# EAGLE design TivaZumoShield (EAGLE 9.4.2)
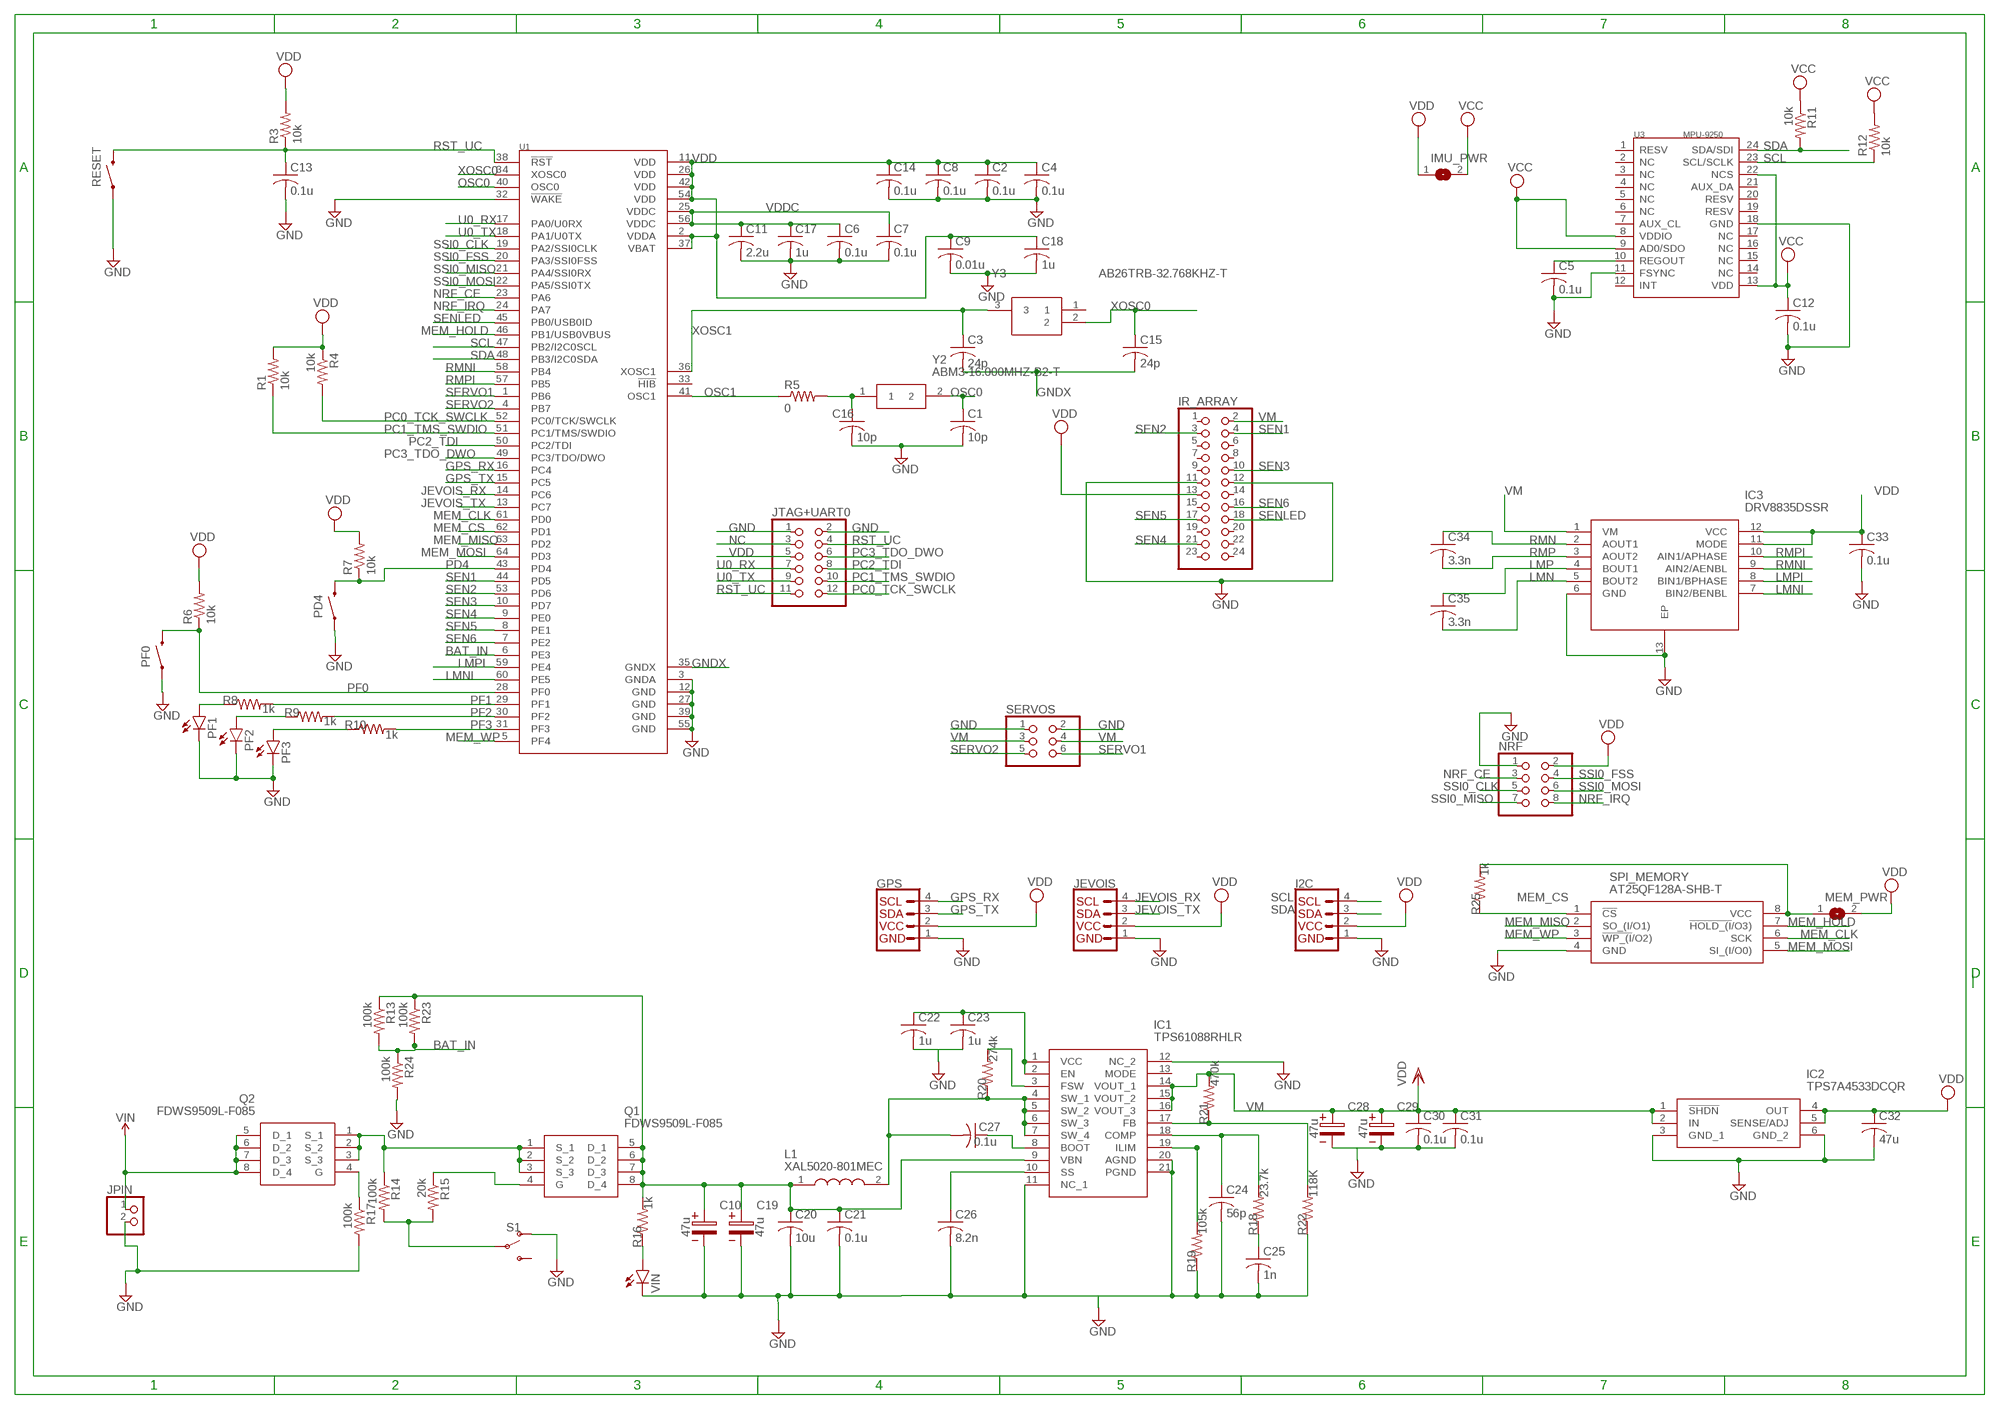
[diagram p0: schematic, sheet 1]

## Parts
C1  10p  C-USC0603  [C0603]
C2  0.1u  C-USC0603  [C0603]
C3  24p  C-USC0603  [C0603]
C4  0.1u  C-USC0603  [C0603]
C5  0.1u  C-USC0603  [C0603]
C6  0.1u  C-USC0603  [C0603]
C7  0.1u  C-USC0603  [C0603]
C8  0.1u  C-USC0603  [C0603]
C9  0.01u  C-USC0603  [C0603]
C10  47u  WCAP-ASLI_5X5,5_865080342006  [3X1.6X1.4(BXCXA)]
C11  2.2u  C-USC0603  [C0603]
C12  0.1u  C-USC0603  [C0603]
C13  0.1u  C-USC0603  [C0603]
C14  0.1u  C-USC0603  [C0603]
C15  24p  C-USC0603  [C0603]
C16  10p  C-USC0603  [C0603]
C17  1u  C-USC0603  [C0603]
C18  1u  C-USC0603  [C0603]
C19  47u  WCAP-ASLI_5X5,5_865080342006  [3X1.6X1.4(BXCXA)]
C20  10u  C-USC0603  [C0603]
C21  0.1u  C-USC0603  [C0603]
C22  1u  C-USC0603  [C0603]
C23  1u  C-USC0603  [C0603]
C24  56p  C-USC0603  [C0603]
C25  1n  C-USC0603  [C0603]
C26  8.2n  C-USC0603  [C0603]
C27  0.1u  C-USC0603  [C0603]
C28  47u  WCAP-ASLI_5X5,5_865080342006  [3X1.6X1.4(BXCXA)]
C29  47u  WCAP-ASLI_5X5,5_865080342006  [3X1.6X1.4(BXCXA)]
C30  0.1u  C-USC0603  [C0603]
C31  0.1u  C-USC0603  [C0603]
C32  47u  C-USC0805K  [C0805K]
C33  0.1u  C-USC0603  [C0603]
C34  3.3n  C-USC0603  [C0603]
C35  3.3n  C-USC0603  [C0603]
GPS  QWIIC_CONNECTORJS-1MM  [1X04_1MM_RA]
I2C  QWIIC_CONNECTORJS-1MM  [1X04_1MM_RA]
IC1  TPS61088RHLR  [RHL(R-PVQFN-N20)_1]
IC2  TPS7A4533DCQR  [SOT127P706X180-6N]
IC3  DRV8835DSSR  [SON50P200X300X80-13N]
IMU_PWR  SJ  [SJ]
IR_ARRAY  PINHD-2X12  [2X12]
JEVOIS  QWIIC_CONNECTORJS-1MM  [1X04_1MM_RA]
JPIN  PINHD-1X2  [1X02]
JTAG+UART0  PINHD-2X6  [2X06]
L1  XAL5020-801MEC  [XAL5020801MEC]
MEM_PWR  SJ  [SJ]
NRF  PINHD-2X4  [2X04]
PD4  RS032G05A3SM-SPST-MOMENTARY-SWSMD-1101NE  [TACTILE-SWITCH-1101NE]
PF0  RS032G05A3SM-SPST-MOMENTARY-SWSMD-1101NE  [TACTILE-SWITCH-1101NE]
PF1  LED-RED0603  [0603-RED]
PF2  LED-GREEN0603  [0603-GREEN]
PF3  LED-BLUE0603  [0603-BLUE]
Q1  FDWS9509L-F085  [FDWS9510LF085]
Q2  FDWS9509L-F085  [FDWS9510LF085]
R1  10k  R-US_R0603  [R0603]
R3  10k  R-US_R0603  [R0603]
R4  10k  R-US_R0603  [R0603]
R5  0  R-US_R0603  [R0603]
R6  10k  R-US_R0603  [R0603]
R7  10k  R-US_R0603  [R0603]
R8  1k  R-US_R0603  [R0603]
R9  1k  R-US_R0603  [R0603]
R10  1k  R-US_R0603  [R0603]
R11  10k  R-US_R0603  [R0603]
R12  10k  R-US_R0603  [R0603]
R13  100k  R-US_R0603  [R0603]
R14  100k  R-US_R0603  [R0603]
R15  20k  R-US_R0603  [R0603]
R16  1k  R-US_R0603  [R0603]
R17  100k  R-US_R0603  [R0603]
R18  23.7k  R-US_R0603  [R0603]
R19  105k  R-US_R0603  [R0603]
R20  274k  R-US_R0603  [R0603]
R21  470k  R-US_R0603  [R0603]
R22  118K  R-US_R0603  [R0603]
R23  100k  R-US_R0603  [R0603]
R24  100k  R-US_R0603  [R0603]
R25  1k  R-US_R0603  [R0603]
RESET  RS032G05A3SM-SPST-MOMENTARY-SWSMD-1101NE  [TACTILE-SWITCH-1101NE]
S1  SWITCH-SPDT-SMD-RIGHT-ANGLE  [SWITCH_SPST_SMD_A]
SERVOS  PINHD-2X3  [2X03]
SPI_MEMORY  AT25QF128A-SHB-T  [SOIC127P790X216-8N]
U1  TM4C123GH6PMI  [QFP50P1200X1200X160-64N]
U3  MPU-9250  [QFN24G-0.4-3X3MM]
VIN  LED-YELLOW0603  [0603-YELLOW]
Y2  ABM3-16.000MHZ-B2-T  [ABM-3]
Y3  AB26TRB-32.768KHZ-T  [AB26TRB]

## Nets
BAT_IN: R13.2 R23.2 R24.1 U1.6(PE3)
GND: C1.2 C2.2 C4.2 C5.2 C6.2 C7.2 C8.2 C9.2 C10.2 C11.2 C12.2 C13.2 C14.2 C16.2 C17.2 C18.2 C19.2 C20.2 C21.2 C22.2 C23.2 C24.2 C25.2 C26.2 C28.2 C29.2 C30.2 C31.2 C32.2 C33.2 GPS.1(GND) I2C.1(GND) IC1.11(NC_1) IC1.12(NC_2) IC1.20(AGND) IC1.21(PGND) IC2.3(GND_1) IC2.6(GND_2) IC3.6(GND) IC3.13(EP) IR_ARRAY.11 IR_ARRAY.12 JEVOIS.1(GND) JPIN.2 JTAG+UART0.1 JTAG+UART0.2 NRF.1 PD4.1 PF0.1 PF1.C PF2.C PF3.C R17.2 R19.1 R22.1 R24.2 RESET.1 S1.1(O) SERVOS.1 SERVOS.2 SPI_MEMORY.4(GND) U1.3(GNDA) U1.12(GND) U1.27(GND) U1.32(!WAKE) U1.39(GND) U1.55(GND) U3.11(FSYNC) U3.18(GND) VIN.C
GNDX: C3.2 C15.2 U1.35(GNDX)
GPS_RX: GPS.4(SCL) U1.16(PC4)
GPS_TX: GPS.3(SDA) U1.15(PC5)
JEVOIS_RX: JEVOIS.4(SCL) U1.14(PC6)
JEVOIS_TX: JEVOIS.3(SDA) U1.13(PC7)
LMN: C35.2 IC3.5(BOUT2)
LMNI: IC3.7(BIN2/BENBL) U1.60(PE5)
LMP: C35.1 IC3.4(BOUT1)
LMPI: IC3.8(BIN1/BPHASE) U1.59(PE4)
MEM_CLK: SPI_MEMORY.6(SCK) U1.61(PD0)
MEM_CS: R25.1 SPI_MEMORY.1(!CS) U1.62(PD1)
MEM_HOLD: SPI_MEMORY.7(!HOLD_(I!/O3)) U1.46(PB1/USB0VBUS)
MEM_MISO: SPI_MEMORY.2(SO_(I/O1)) U1.63(PD2)
MEM_MOSI: SPI_MEMORY.5(SI_(I/O0)) U1.64(PD3)
MEM_WP: SPI_MEMORY.3(!WP_(I!/O2)) U1.5(PF4)
N$1: PF1.A R8.1
N$3: C16.1 R5.2 Y2.1
N$4: R14.2 R15.2 S1.2(P)
N$5: C5.1 U3.10(REGOUT)
N$7 [supply]: MEM_PWR.1 R25.2 SPI_MEMORY.8(VCC)
N$8: C10.1 C19.1 C20.1 C21.1 IC1.9(VBN) L1.1 Q1.5(D_1) Q1.6(D_2) Q1.7(D_3) Q1.8(D_4) R13.1 R16.2 R23.1
N$9: PF2.A R9.1
N$10: PF3.A R10.1
N$12: Q1.4(G) R15.1
N$14: Q1.1(S_1) Q1.2(S_2) Q1.3(S_3) Q2.1(S_1) Q2.2(S_2) Q2.3(S_3) R14.1
N$16: R16.1 VIN.A
N$17: C27.2 IC1.4(SW_1) IC1.5(SW_2) IC1.6(SW_3) IC1.7(SW_4) L1.2 R20.1
N$18: Q2.4(G) R17.1
N$19: C24.1 IC1.18(COMP) R18.2
N$20: C22.1 C23.1 IC1.1(VCC) IC1.2(EN)
N$22: C25.1 R18.1
N$23: IC1.3(FSW) R20.2
N$24: IC1.19(ILIM) R19.2
N$25: C26.1 IC1.10(SS)
N$26: C27.1 IC1.8(BOOT)
N$28: IC1.17(FB) R21.1 R22.2
NC: JTAG+UART0.3
NRF_CE: NRF.3 U1.23(PA6)
NRF_IRQ: NRF.8 U1.24(PA7)
OSC0: C1.1 U1.40(OSC0) Y2.2
OSC1: R5.1 U1.41(OSC1)
PC0_TCK_SWCLK: JTAG+UART0.12 R4.2 U1.52(PC0/TCK/SWCLK)
PC1_TMS_SWDIO: JTAG+UART0.10 R1.1 U1.51(PC1/TMS/SWDIO)
PC2_TDI: JTAG+UART0.8 U1.50(PC2/TDI)
PC3_TDO_DWO: JTAG+UART0.6 U1.49(PC3/TDO/DWO)
PD4: PD4.2 R7.1 U1.43(PD4)
PF0: PF0.2 R6.1 U1.28(PF0)
PF1: R8.2 U1.29(PF1)
PF2: R9.2 U1.30(PF2)
PF3: R10.2 U1.31(PF3)
RMN: C34.1 IC3.2(AOUT1)
RMNI: IC3.9(AIN2/AENBL) U1.58(PB4)
RMP: C34.2 IC3.3(AOUT2)
RMPI: IC3.10(AIN1/APHASE) U1.57(PB5)
RST_UC: C13.1 JTAG+UART0.4 JTAG+UART0.11 R3.1 RESET.2 U1.38(!RST)
SCL: I2C.4(SCL) R12.1 U1.47(PB2/I2C0SCL) U3.23(SCL/SCLK)
SDA: I2C.3(SDA) R11.2 U1.48(PB3/I2C0SDA) U3.24(SDA/SDI)
SEN1: IR_ARRAY.4 U1.44(PD5)
SEN2: IR_ARRAY.3 U1.53(PD6)
SEN3: IR_ARRAY.10 U1.10(PD7)
SEN4: IR_ARRAY.21 U1.9(PE0)
SEN5: IR_ARRAY.17 U1.8(PE1)
SEN6: IR_ARRAY.16 U1.7(PE2)
SENLED: IR_ARRAY.18 U1.45(PB0/USB0ID)
SERVO1: SERVOS.6 U1.1(PB6)
SERVO2: SERVOS.5 U1.4(PB7)
SSI0_CLK: NRF.5 U1.19(PA2/SSI0CLK)
SSI0_FSS: NRF.4 U1.20(PA3/SSI0FSS)
SSI0_MISO: NRF.7 U1.21(PA4/SSI0RX)
SSI0_MOSI: NRF.6 U1.22(PA5/SSI0TX)
U0_RX: JTAG+UART0.7 U1.17(PA0/U0RX)
U0_TX: JTAG+UART0.9 U1.18(PA1/U0TX)
VCC [supply2]: C12.1 IMU_PWR.2 R11.1 R12.2 U3.8(VDDIO) U3.9(AD0/SDO) U3.13(VDD) U3.22(NCS)
VDD [supply]: C2.1 C4.1 C8.1 C9.1 C14.1 C18.1 C32.1 C33.1 GPS.2(VCC) I2C.2(VCC) IC2.4(OUT) IC2.5(SENSE/ADJ) IC3.11(MODE) IC3.12(VCC) IMU_PWR.1 IR_ARRAY.13 JEVOIS.2(VCC) JTAG+UART0.5 MEM_PWR.2 NRF.2 R1.2 R3.2 R4.1 R6.2 R7.2 U1.2(VDDA) U1.11(VDD) U1.26(VDD) U1.37(VBAT) U1.42(VDD) U1.54(VDD)
VDDC: C6.1 C7.1 C11.1 C17.1 U1.25(VDDC) U1.56(VDDC)
VIN: JPIN.1 Q2.5(D_1) Q2.6(D_2) Q2.7(D_3) Q2.8(D_4)
VM: C28.1 C29.1 C30.1 C31.1 IC1.14(VOUT_1) IC1.15(VOUT_2) IC1.16(VOUT_3) IC2.1(!SHDN) IC2.2(IN) IC3.1(VM) IR_ARRAY.2 R21.2 SERVOS.3 SERVOS.4 ; supply symbol labelled VDD
XOSC0: C15.1 U1.34(XOSC0) Y3.2
XOSC1: C3.1 U1.36(XOSC1) Y3.3
Unconnected: IC1.13(MODE) IR_ARRAY.1 IR_ARRAY.5 IR_ARRAY.6 IR_ARRAY.7 IR_ARRAY.8 IR_ARRAY.9 IR_ARRAY.14 IR_ARRAY.15 IR_ARRAY.19 IR_ARRAY.20 IR_ARRAY.22 IR_ARRAY.23 IR_ARRAY.24 S1.3(S) U1.33(!HIB) U3.1(RESV) U3.2(NC) U3.3(NC) U3.4(NC) U3.5(NC) U3.6(NC) U3.7(AUX_CL) U3.12(INT) U3.14(NC) U3.15(NC) U3.16(NC) U3.17(NC) U3.19(RESV) U3.20(RESV) U3.21(AUX_DA) Y3.1

## Library data of the parts
C1-C9 C11-C18 C20-C27 C30-C35 = rcl:C-US: CAPACITOR, American symbol; SPICEPREFIX: C
C10 C19 C28 C29 = Wurth_Elektronik_Passive_Capacitors_rev18b:WCAP-ASLI: WCAP-ASLI Aluminum Electrolytic Capacitors Characteristics Aluminum Electrolytic Capacitor Recommended soldering: Reflow Operating temperature: -55 °C to +105 °C Low impedance product series Load life:2000 h @ +105 °C Package name and Variant abbreviation: Package: Package: B X C X A = length of the solder pad X width of the solder pad X pitch of the solder pad. <http://katalog.we-online.de/media/images/eisos/WCAP-ASLI_pf2.jpg> Details see: http://katalog.we-online.de/en/pbs/WCAP-ASLI Updated by: Yingchun,Shan Updated: 2017-03-16 2017 (C) Wurth Elektronik; WE-NUMBER: 865080342006/47uF
GPS I2C JEVOIS = SparkFun-Connectors:QWIIC_CONNECTOR: SparkFun I2C Standard Qwiic Connector An SMD 1mm pitch JST connector makes it easy and quick (get it? Qwiic?) to connect I2C devices to each other. The Qwiic system <http://www.sparkfun.com/qwiic> enables fast and solderless connection between popular platforms and various sensors and actuators. We carry 200mm <https://www.sparkfun.com/products/14204>, 100mm <https://www.sparkfun.com/products/14205>, 50mm <https://www.sparkfun.com/products/14206>, and breadboard friendly <https://www.sparkfun.com/products/14207> Qwiic cables. We also offer 10 pcs strips <https://www.sparkfun.com/products/14323> the SMD connectors.
IC1 = TPS61088RHLR:TPS61088RHLR: 10-A Fully-Integrated Synchronous Boost Converter Source: Datasheet <http://www.ti.com/lit/gpn/tps61088>; DESCRIPTION: 10-A Fully-Integrated Synchronous Boost Converter; HEIGHT: mm; MANUFACTURER_NAME: Texas Instruments; MANUFACTURER_PART_NUMBER: TPS61088RHLR; MOUSER_PART_NUMBER: 595-TPS61088RHLR; MOUSER_PRICE-STOCK: https://www.mouser.com/Search/Refine.aspx?Keyword=595-TPS61088RHLR
IC2 = TPS7A4533DCQR:TPS7A4533DCQR: Low-Noise Fast-Transient-Response 1.5-A Low-Dropout Voltage Regulators Source: Datasheet <http://www.mouser.com/ds/2/405/tps7a4533-449443.pdf>; DESCRIPTION: Low-Noise Fast-Transient-Response 1.5-A Low-Dropout Voltage Regulators; HEIGHT: 1.8mm; MANUFACTURER_NAME: Texas Instruments; MANUFACTURER_PART_NUMBER: TPS7A4533DCQR; MOUSER_PART_NUMBER: 595-TPS7A4533DCQR; MOUSER_PRICE-STOCK: https://www.mouser.com/Search/Refine.aspx?Keyword=595-TPS7A4533DCQR
IC3 = DRV8835DSSR:DRV8835DSSR: Dual Low Voltage H-Bridge 1.5A WSON12EP Texas Instruments DRV8835DSSR Stepper Motor Driver IC, 11 V 1.5A, 12-Pin WSON Source: Datasheet <http://www.ti.com/general/docs/lit/getliterature.tsp?genericPartNumber=drv8835&fileType=pdf>; DESCRIPTION: Dual Low Voltage H-Bridge 1.5A WSON12EP Texas Instruments DRV8835DSSR Stepper Motor Driver IC, 11 V 1.5A, 12-Pin WSON; HEIGHT: 0.8mm; MANUFACTURER_NAME: Texas Instruments; MANUFACTURER_PART_NUMBER: DRV8835DSSR; MOUSER_PART_NUMBER: 595-DRV8835DSSR; MOUSER_PRICE-STOCK: https://www.mouser.com/Search/Refine.aspx?Keyword=595-DRV8835DSSR; RS_PART_NUMBER: 8136485; RS_PRICE-STOCK: https://uk.rs-online.com/web/p/products/8136485
IMU_PWR MEM_PWR = jumper:SJ: SMD solder JUMPER
IR_ARRAY = pinhead:PINHD-2X12: PIN HEADER
JPIN = DC_LOAD_AU:PINHD-1X2: PIN HEADER
JTAG+UART0 = pinhead:PINHD-2X6: PIN HEADER
L1 = XAL5020-801MEC:XAL5020-801MEC: Fixed Inductors 0.8uH 20% 13A 11.8mOhms AEC-Q200 Source: Datasheet <https://www.coilcraft.com/pdfs/xal5020.pdf>; DESCRIPTION: Fixed Inductors 0.8uH 20% 13A 11.8mOhms AEC-Q200; HEIGHT: 2mm; MANUFACTURER_NAME: COILCRAFT; MANUFACTURER_PART_NUMBER: XAL5020-801MEC; MOUSER_PART_NUMBER: 994-XAL5020-801MEC; MOUSER_PRICE-STOCK: https://www.mouser.com/Search/Refine.aspx?Keyword=994-XAL5020-801MEC
NRF = pinhead:PINHD-2X4: PIN HEADER
PD4 PF0 RESET = BeagleBone_Blue_R3:RS032G05A3SM-SPST-MOMENTARY-SW: 6x3.5mm 2-pin Momentary Switch (Push-button) Digikey Link <https://www.digikey.com/products/en?keywords=CKN10388TR-ND> Datasheet <https://media.digikey.com/pdf/Data%20Sheets/C&K/RS-032G05_-SM_RT.pdf>; PROD_ID: SWCH-00815
PF1 = BeagleBone_Blue_R3:LED-RED
PF2 = BeagleBone_Blue_R3:LED-GREEN
PF3 = BeagleBone_Blue_R3:LED-BLUE
Q1 Q2 = FDWS9509L-F085:FDWS9509L-F085: PMOS PWR56 40V 8 MOHM Source: Datasheet <http://www.onsemi.com/pub/Collateral/FDWS9509L-F085-D.PDF>; DESCRIPTION: PMOS PWR56 40V 8 MOHM; HEIGHT: mm; MANUFACTURER_NAME: ON Semiconductor; MANUFACTURER_PART_NUMBER: FDWS9509L-F085; MOUSER_PART_NUMBER: 863-FDWS9509L-F085; MOUSER_PRICE-STOCK: https://www.mouser.com/Search/Refine.aspx?Keyword=863-FDWS9509L-F085; RS_PART_NUMBER: 1784501P; RS_PRICE-STOCK: http://uk.rs-online.com/web/p/products/1784501P
R1 R3-R25 = rcl:R-US_: RESISTOR, American symbol; SPICEPREFIX: R
S1 = SparkFun-Switches:SWITCH-SPDT: Single Pole, Double Throw (SPDT) Switch Single-pole, double-throw (SPDT) switch. Variant Overview SMD-AYZ0202 Surface Mount DPDT Switch <https://www.sparkfun.com/products/597> (COM-00597) Used on e.g. LilyPad Arduino USB - ATmega32U4 Board <https://www.sparkfun.com/products/12049> PTH-11.6X4.0MM SPDT Mini Power Switch <https://www.sparkfun.com/products/102> (COM-00102) Used on e.g. SparkFun Simon Says - Through-Hole Soldering Kit <https://www.sparkfun.com/products/10547> (KIT-10547) PTH-11.6X4.0MM-KIT KIT version of SPDT Mini Power Switch - Simplifies soldering by removing tStop of switch pins - only one side can be soldered. PTH-11.6X4.0MM-LOCK LOCK version of SPDT Mini Power Switch - Offset pins hold switch in place for easier soldering. SMD-RIGHT-ANGLE Surface Mount Right Angle Switch <https://www.sparkfun.com/products/10860> (COM-10860) Used on e.g. SparkFun ESP8266 Thing <https://www.sparkfun.com/products/13231>; PROD_ID: SWCH-10651; SF_SKU: COM-10860
SERVOS = pinhead:PINHD-2X3: PIN HEADER
SPI_MEMORY = AT25QF128A-SHB-T:AT25QF128A-SHB-T: NOR Flash 128Mb, 133MHz, QPI,8-SOIC-W, IND TEMP, 2.7-3.6V, T&R Source: Datasheet <https://www.adestotech.com/wp-content/uploads/AT25QF128A_Data_Sheet_RevA_03-19-2019-1.pdf>; DESCRIPTION: NOR Flash 128Mb, 133MHz, QPI,8-SOIC-W, IND TEMP, 2.7-3.6V, T&R; HEIGHT: 2.16mm; MANUFACTURER_NAME: Adesto Technologies; MANUFACTURER_PART_NUMBER: AT25QF128A-SHB-T; MOUSER_PART_NUMBER: 988-AT25QF128A-SHB-T; MOUSER_PRICE-STOCK: https://www.mouser.com/Search/Refine.aspx?Keyword=988-AT25QF128A-SHB-T
U1 = TM4C123GH6PMI:TM4C123GH6PMI: MCU 32-Bit Tiva C ARM Cortex M4F RISC 256KB Flash 1.2V/3.3V 64-Pin LQFP Tray/Tube; AVAILABILITY: Unavailable; DESCRIPTION: MCU 32-Bit Tiva C ARM Cortex M4F RISC 256KB Flash 1.2V/3.3V 64-Pin LQFP Tray/Tube; MF: Texas Instruments; MP: TM4C123GH6PMI; PACKAGE: LQFP-64 Texas Instruments; PRICE: None
U3 = BeagleBone_Blue_R3:MPU-9250: 314990005; MPN: MPU-9250
VIN = BeagleBone_Blue_R3:LED-YELLOW
Y2 = ABM3-16.000MHZ-B2-T:ABM3-16.000MHZ-B2-T: ABRACON - ABM3-16.000MHZ-B2-T - CRYSTAL, 16MHZ, 18PF CL, 5X3.2MM, SMT Source: Datasheet <https://abracon.com/Resonators/abm3.pdf>; DESCRIPTION: ABRACON - ABM3-16.000MHZ-B2-T - CRYSTAL, 16MHZ, 18PF CL, 5X3.2MM, SMT; HEIGHT: mm; MANUFACTURER_NAME: ABRACON; MANUFACTURER_PART_NUMBER: ABM3-16.000MHZ-B2-T; MOUSER_PART_NUMBER: 815-ABM3-16-B2-T; MOUSER_PRICE-STOCK: https://www.mouser.com/Search/Refine.aspx?Keyword=815-ABM3-16-B2-T
Y3 = AB26TRB-32.768KHZ-T:AB26TRB-32.768KHZ-T: ABRACON - AB26TRB-32.768KHZ-T - CRYSTAL, 32.768KHZ, 12.5PF, SMD Source: Datasheet <http://www.abracon.com/Resonators/AB26TRB.pdf>; DESCRIPTION: ABRACON - AB26TRB-32.768KHZ-T - CRYSTAL, 32.768KHZ, 12.5PF, SMD; HEIGHT: mm; MANUFACTURER_NAME: ABRACON; MANUFACTURER_PART_NUMBER: AB26TRB-32.768KHZ-T; MOUSER_PART_NUMBER: 815-AB26TRB-32.76KHZ; MOUSER_PRICE-STOCK: https://www.mouser.com/Search/Refine.aspx?Keyword=815-AB26TRB-32.76KHZ

## Net classes
1 supply: width 0.381 mm
2 supply2: width 0.203 mm

## Board
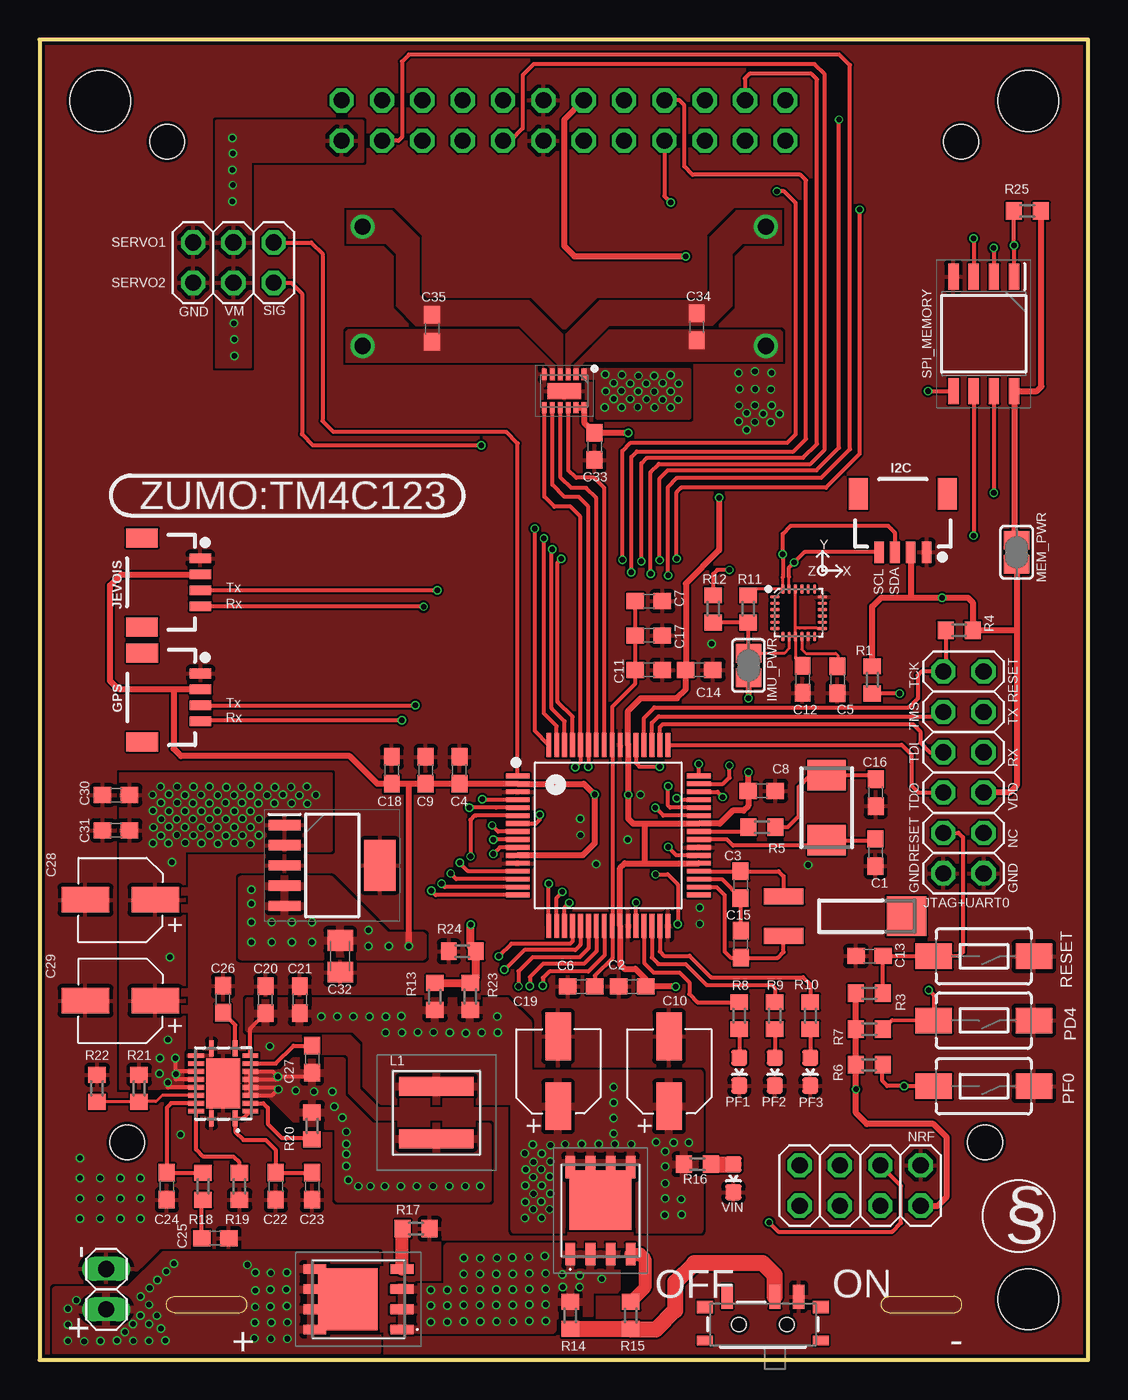
[diagram p1: board, top side]
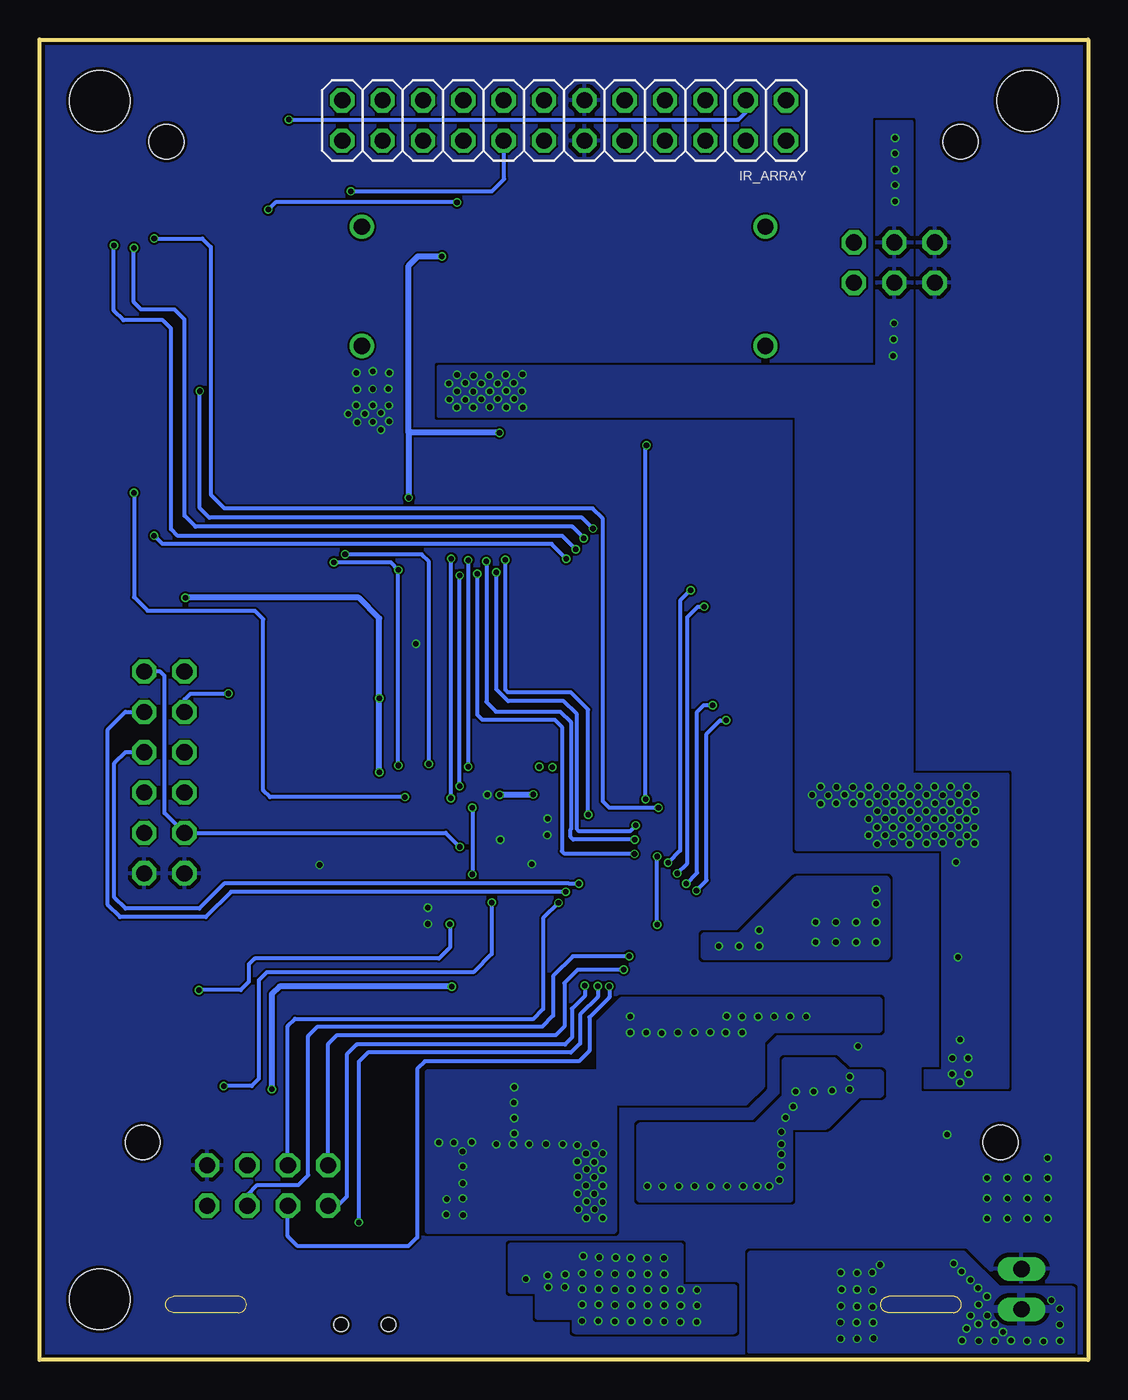
[diagram p2: board, bottom side, seen from below]

Size 66 x 83.1 mm. Coordinates in mm from the lower left corner, seen from the top.
Outline: 0,0 66,0 66,83.1 0,83.1 0,0
Copper layers (1*16): Top 0.035559375mm / dielectric 1.6mm / Bottom 0.035559375mm
Design rules "jlcpcb2layer": minimum track width 5mil, minimum drill 12mil, track to track 5mil, track to pad 5mil, pad to pad 5mil, via to via 5mil, smd to smd 5mil, copper to edge 8mil, drill to drill 6mil, minimum pad ring 5mil, minimum via ring 3mil, stop-mask expansion 2.5mil, vias tented up to drill 0mil, thermal gap 10mil
Holes 2.18 mm at 5.51,13.69 59.51,13.69 58.01,76.68 8.03,76.68
Holes 3.81 mm at 62.23,3.81 62.23,79.25 3.81,79.25
Milling: 8 lines

### Footprints (pad centres in the part's own frame; a part is rotated, then mirrored left to right if it is on the bottom)
C0603 = smd 1.1 x 1: 1 -0.85,0; 2 0.85,0
3X1.6X1.4(BXCXA) = smd 3 x 1.6: 1 2.2,0; 2 -2.2,0
C0805K = smd 1.3 x 1.6: 1 -1,0; 2 1,0
1X04_1MM_RA = smd 0.6 x 1.35: 1 -1.5,0; 2 -0.5,0; 3 0.5,0; 4 1.5,0 | smd 1.2 x 2: NC1 2.8,-3.675; NC2 -2.8,-3.675
RHL(R-PVQFN-N20)_1 = smd 0.99 x 0.3: 1 -2.2,-0.75; 10 2.2,-0.75; 11 2.2,0.75; 20 -2.2,0.75 | smd 0.3 x 0.99: 2 -1.75,-1.7; 3 -1.25,-1.7; 4 -0.75,-1.7; 5 -0.25,-1.7; 6 0.25,-1.7; 7 0.75,-1.7; 8 1.25,-1.7; 9 1.75,-1.7; 12 1.75,1.7; 13 1.25,1.7; 14 0.75,1.7; 15 0.25,1.7; 16 -0.25,1.7; 17 -0.75,1.7; 18 -1.25,1.7; 19 -1.75,1.7 | smd 3.15 x 2.15: 21 0,0
SOT127P706X180-6N = smd 2 x 0.65: 1 -3,2.54; 2 -3,1.27; 3 -3,0; 4 -3,-1.27; 5 -3,-2.54 | smd 2 x 3.2: 6 3,0
SON50P200X300X80-13N = smd 0.7 x 0.3: 1 -1.05,1.25; 2 -1.05,0.75; 3 -1.05,0.25; 4 -1.05,-0.25; 5 -1.05,-0.75; 6 -1.05,-1.25; 7 1.05,-1.25; 8 1.05,-0.75; 9 1.05,-0.25; 10 1.05,0.25; 11 1.05,0.75; 12 1.05,1.25 | smd 1 x 2.1: 13 0,0
SJ = smd 1.168 x 1.6: 1 -0.762,0; 2 0.762,0
2X12 = drill 1.016 octagon: 1 -13.97,-1.27; 2 -13.97,1.27; 3 -11.43,-1.27; 4 -11.43,1.27; 5 -8.89,-1.27; 6 -8.89,1.27; 7 -6.35,-1.27; 8 -6.35,1.27; 9 -3.81,-1.27; 10 -3.81,1.27; 11 -1.27,-1.27; 12 -1.27,1.27; 13 1.27,-1.27; 14 1.27,1.27; 15 3.81,-1.27; 16 3.81,1.27; 17 6.35,-1.27; 18 6.35,1.27; 19 8.89,-1.27; 20 8.89,1.27; 21 11.43,-1.27; 22 11.43,1.27; 23 13.97,-1.27; 24 13.97,1.27
1X02 = drill 1.016 long: 1 -1.27,0; 2 1.27,0
2X06 = drill 1.016 octagon: 1 -6.35,-1.27; 2 -6.35,1.27; 3 -3.81,-1.27; 4 -3.81,1.27; 5 -1.27,-1.27; 6 -1.27,1.27; 7 1.27,-1.27; 8 1.27,1.27; 9 3.81,-1.27; 10 3.81,1.27; 11 6.35,-1.27; 12 6.35,1.27
XAL5020801MEC = smd 1.18 x 4.7: 1 -1.655,0; 2 1.655,0
2X04 = drill 1.016 octagon: 1 -3.81,-1.27; 2 -3.81,1.27; 3 -1.27,-1.27; 4 -1.27,1.27; 5 1.27,-1.27; 6 1.27,1.27; 7 3.81,-1.27; 8 3.81,1.27
TACTILE-SWITCH-1101NE = smd 2.3 x 1.6: 1 -3.15,0; 2 3.15,0
0603-RED = smd 1 x 1: A 0,-0.877; C 0,0.877
0603-GREEN = smd 1 x 1: A 0,-0.877; C 0,0.877
0603-BLUE = smd 1 x 1: A 0,-0.877; C 0,0.877
FDWS9510LF085 = smd 0.61 x 1.42: 1 -1.905,-2.745; 2 -0.635,-2.745; 3 0.635,-2.745; 4 1.905,-2.745 | smd 0.61 x 0.92: 5 1.905,2.995; 6 0.635,2.995; 7 -0.635,2.995; 8 -1.905,2.995 | smd 3.91 x 3.75: 9 0,0.66 | smd 0.255 x 0.5: 10 -2.082,2.285; 11 2.082,2.285
R0603 = smd 1 x 1.1: 1 -0.85,0; 2 0.85,0
SWITCH_SPST_SMD_A = smd 0.7 x 1.5: 1 -2.25,-1.75; 2 -0.75,-1.75; 3 2.25,-1.75 | smd 1 x 0.6: GND1 -3.65,1; GND3 3.65,1 | smd 1 x 0.8: GND2 -3.65,-1.1; GND4 3.65,-1.1 | hole 0.9: -1.5,0; 1.5,0
2X03 = drill 1.016 octagon: 1 -2.54,-1.27; 2 -2.54,1.27; 3 0,-1.27; 4 0,1.27; 5 2.54,-1.27; 6 2.54,1.27
SOIC127P790X216-8N = smd 1.65 x 0.65: 1 -3.6,1.905; 2 -3.6,0.635; 3 -3.6,-0.635; 4 -3.6,-1.905; 5 3.6,-1.905; 6 3.6,-0.635; 7 3.6,0.635; 8 3.6,1.905
QFP50P1200X1200X160-64N = smd 1.5 x 0.3: 1 -5.7,3.75; 2 -5.7,3.25; 3 -5.7,2.75; 4 -5.7,2.25; 5 -5.7,1.75; 6 -5.7,1.25; 7 -5.7,0.75; 8 -5.7,0.25; 9 -5.7,-0.25; 10 -5.7,-0.75; 11 -5.7,-1.25; 12 -5.7,-1.75; 13 -5.7,-2.25; 14 -5.7,-2.75; 15 -5.7,-3.25; 16 -5.7,-3.75; 33 5.7,-3.75; 34 5.7,-3.25; 35 5.7,-2.75; 36 5.7,-2.25; 37 5.7,-1.75; 38 5.7,-1.25; 39 5.7,-0.75; 40 5.7,-0.25; 41 5.7,0.25; 42 5.7,0.75; 43 5.7,1.25; 44 5.7,1.75; 45 5.7,2.25; 46 5.7,2.75; 47 5.7,3.25; 48 5.7,3.75 | smd 0.3 x 1.5: 17 -3.75,-5.7; 18 -3.25,-5.7; 19 -2.75,-5.7; 20 -2.25,-5.7; 21 -1.75,-5.7; 22 -1.25,-5.7; 23 -0.75,-5.7; 24 -0.25,-5.7; 25 0.25,-5.7; 26 0.75,-5.7; 27 1.25,-5.7; 28 1.75,-5.7; 29 2.25,-5.7; 30 2.75,-5.7; 31 3.25,-5.7; 32 3.75,-5.7; 49 3.75,5.7; 50 3.25,5.7; 51 2.75,5.7; 52 2.25,5.7; 53 1.75,5.7; 54 1.25,5.7; 55 0.75,5.7; 56 0.25,5.7; 57 -0.25,5.7; 58 -0.75,5.7; 59 -1.25,5.7; 60 -1.75,5.7; 61 -2.25,5.7; 62 -2.75,5.7; 63 -3.25,5.7; 64 -3.75,5.7
QFN24G-0.4-3X3MM = smd 0.6 x 0.2: 1 -1.5,1; 2 -1.5,0.6; 3 -1.5,0.2; 4 -1.5,-0.2; 5 -1.5,-0.6; 6 -1.5,-1; 13 1.5,-1; 14 1.5,-0.6; 15 1.5,-0.2; 16 1.5,0.2; 17 1.5,0.6; 18 1.5,1 | smd 0.2 x 0.6: 7 -1,-1.5; 8 -0.6,-1.5; 9 -0.2,-1.5; 10 0.2,-1.5; 11 0.6,-1.5; 12 1,-1.5; 19 1,1.5; 20 0.6,1.5; 21 0.2,1.5; 22 -0.2,1.5; 23 -0.6,1.5; 24 -1,1.5
0603-YELLOW = smd 1 x 1: A 0,-0.877; C 0,0.877
ABM-3 = smd 1.9 x 2.4: 1 -2.05,0; 2 2.05,0
AB26TRB = smd 2.5 x 2.5: 1 0,0 | smd 2.5 x 1: 2 7.75,1.25; 3 7.75,-1.25

### Placement (x,y rotation side)
C1  52.61,31.94 270 top
C2  37.31,23.51 180 top
C3  44.12,29.9 270 top
C4  26.43,37.11 90 top
C5  50.22,42.82 270 top
C6  34.11,23.5 180 top
C7  38.35,47.75 0 top
C8  45.47,35.81 0 top
C9  24.3,37.11 90 top
C10  39.62,18.16 270 top
C11  38.35,43.43 0 top
C12  48.03,42.83 270 top
C13  52.24,25.41 180 top
C14  41.53,43.43 0 top
C15  44.15,26.15 90 top
C16  52.63,35.71 270 top
C17  38.35,45.59 0 top
C18  22.17,37.11 90 top
C19  32.64,18.16 270 top
C20  14.21,22.67 90 top
C21  16.38,22.67 90 top
C22  14.86,10.92 270 top
C23  17.14,10.92 270 top
C24  8,10.92 270 top
C25  11.05,7.66 0 top
C26  11.54,22.69 90 top
C27  17.14,18.92 270 top
C28  5.08,28.96 0 top
C29  5.08,22.61 0 top
C30  4.81,35.55 180 top
C31  4.81,33.33 180 top
C32  18.92,25.4 270 top
C33  34.93,57.49 270 top
C34  41.36,65.02 90 top
C35  24.7,64.92 270 top
GPS  10.12,41.7 270 top
I2C  54.34,50.83 180 top
IC1  11.56,17.4 90 top
IC2  18.41,31.11 0 top
IC3  33.02,60.98 270 top
IMU_PWR  44.62,43.71 90 top
IR_ARRAY  32.98,78.01 180 bottom
JEVOIS  10.11,48.94 270 top
JPIN  4.19,4.45 90 top
JTAG+UART0  58.16,36.98 90 top
L1  24.98,15.56 270 top
MEM_PWR  61.5,50.84 270 top
NRF  51.65,10.97 180 top
PD4  59.44,21.36 180 top
PF0  59.44,17.22 180 top
PF1  44.04,18.14 180 top
PF2  46.28,18.14 180 top
PF3  48.51,18.14 180 top
Q1  35.31,9.4 0 top
Q2  20.07,3.81 90 top
R1  52.42,42.81 90 top
R3  52.23,23.07 180 top
R4  57.89,45.93 180 top
R5  45.47,33.53 0 top
R6  52.22,18.57 180 top
R7  52.24,20.81 180 top
R8  44.04,21.67 90 top
R9  46.28,21.67 90 top
R10  48.51,21.67 90 top
R11  44.6,47.27 90 top
R12  42.4,47.27 270 top
R13  24.88,22.87 90 top
R14  33.4,2.79 270 top
R15  37.21,2.79 270 top
R16  41.4,12.32 180 top
R17  23.7,8.25 0 top
R18  10.29,10.92 90 top
R19  12.57,10.92 90 top
R20  17.14,14.73 270 top
R21  6.26,17.09 90 top
R22  3.61,17.09 270 top
R23  27.11,22.88 90 top
R24  26.61,25.71 180 top
R25  62.18,72.32 0 top
RESET  59.44,25.4 180 top
S1  45.53,2.22 180 top
SERVOS  12.2,69.07 0 top
SPI_MEMORY  59.43,64.59 270 top
U1  35.79,33.01 0 top
U3  47.78,47.03 0 top
VIN  43.68,11.43 180 top
Y2  49.54,34.75 270 top
Y3  54.58,27.92 180 top

### Tracks (layer width: path | path; a pad name or v marks a point on that pad's centre or on a via)
BAT_IN  (via drill 0.35)
  Top 0.254: U1.6 27.46,34.26 27.46,34.25 27.38,34.25 27.12,33.99 v27.12,31.69
  Top 0.508: R13.2 27.09,23.72 R23.2 27.46,24.08 R24.1 27.13,26.04 v27.13,27.39
  Bottom 0.254: v27.13,27.39 27.13,31.68 v27.12,31.69
GND  (via drill 0.35, 0.35 pad 0)
  other vias: 2.54,11.43 3.81,11.43 5.08,11.43 5.08,10.16 3.81,10.16 2.54,10.16 2.54,8.89 3.81,8.89 5.08,8.89 6.35,8.89 6.35,10.16 6.35,11.43 2.54,12.7 48.38,31.15 41.56,28.47 41.56,27.44 37.82,35.58 42.31,45.07 37.01,32.75 34.05,33.04 35.03,31.21 34.03,34.07 45.04,61.1 44.02,60.07 46.08,60.08 46.07,62.13 43.99,62.13 46.03,61.1 44.06,61.12 45.03,60.09 45.03,62.22 44.51,59.6 45.54,59.54 46.58,59.54 46.01,59.01 45.03,59.03 44.51,58.54 44,59.09 8.87,14.17 14.49,19.73
  pour Top (rank 3): -2.32,84.03 67.31,84.03 67.31,-1.27 -2.32,-1.27
  pour Bottom (rank 3): 68.58,84.65 68.58,-3.26 -3.81,-3.26 -3.81,84.65
GNDX
  Top 0.254: U1.35 42.94,30.26 44.12,29.07 C3.2 44.12,27.03 C15.2
GPS_RX  (via drill 0.35, 0.35 pad 0)
  Top 0.254: U1.16 24.93,29.26 v24.66,29.53 | v22.79,40.25 10.18,40.25 GPS.4
  Bottom 0.254: v24.66,29.53 24.01,30.18 24.01,39.41 23.17,40.25 v22.79,40.25
GPS_TX  (via drill 0.35, 0.35 pad 0)
  Top 0.254: U1.15 25.51,29.76 v25.3,29.96 | GPS.3 v23.63,41.2 v23.64,41.21
  Bottom 0.254: v25.3,29.96 24.61,30.65 24.61,40.78 24.19,41.21 v23.64,41.21
JEVOIS_RX  (via drill 0.35, 0.35 pad 0)
  Top 0.254: U1.14 26.22,30.26 25.87,30.61 v25.87,30.62 | v24.17,47.41 10.13,47.41 JEVOIS.4
  Bottom 0.254: v25.87,30.62 25.23,31.25 25.23,46.75 24.56,47.41 v24.17,47.41
JEVOIS_TX  (via drill 0.35, 0.35 pad 0)
  Top 0.254: U1.13 26.98,30.76 v26.45,31.29 | JEVOIS.3 v25.02,48.44 v25.02,48.45
  Bottom 0.254: v25.02,48.45 25.68,47.79 25.68,32.05 v26.45,31.29
LMN  (via drill 1.02)
  other vias: 20.32,63.83
  pour Top (isolate 0.127, no thermals): 32.43,61.65 32.43,62.59 30.18,64.84 19.43,64.84 19.27,64.69 19.27,62.82 19.28,62.8 31.75,62.8 32.13,62.43 32.13,61.66 32.14,61.65 32.43,61.65 32.43,61.66
LMNI  (via drill 0.35)
  Top 0.254: v33.72,37.3 34.04,37.62 U1.60 34.04,53.08 33.42,53.7 32.41,53.7 31.77,54.34 IC3.7
LMP  (via drill 1.02)
  other vias: 20.32,71.32
  pour Top (isolate 0.127, no thermals): 32.95,61.66 32.95,64.53 30.81,66.67 24.27,66.67 23.91,67.03 23.91,70.61 22.2,72.32 19.33,72.32 19.33,72.33 19.33,70.28 19.33,70.28 21.77,70.28 22.42,69.62 22.42,66.35 23.67,65.1 30.19,65.1 32.61,62.68 32.61,61.65 32.61,61.65
LMPI  (via drill 0.35)
  Top 0.254: v34.54,37.32 v34.54,37.33 U1.59 34.54,53.71 33.94,54.31 33.05,54.31 32.27,55.09 IC3.8
MEM_CLK  (via drill 0.35)
  Top 0.254: U1.61 33.54,40.49 32.61,41.42 32.61,50.19 v32.84,50.42 | v58.8,51.88 SPI_MEMORY.6
  Bottom 0.254: v32.84,50.42 33.78,51.35 58.27,51.35 v58.8,51.88
MEM_CS  (via drill 0.35)
  Top 0.254: U1.62 33.04,40.19 32.23,41.01 32.23,51.03 v32.26,51.03 | SPI_MEMORY.1 v61.33,70.15 R25.1
  Bottom 0.254: v32.26,51.03 33.1,51.86 57.31,51.86 57.73,52.29 57.73,64.92 58.25,65.45 60.73,65.45 61.33,66.05 v61.33,70.15
MEM_HOLD  (via drill 0.35)
  Top 0.254: U1.46 42.67,35.76 v43,35.43 | v60.07,54.57 SPI_MEMORY.7
  Bottom 0.254: v43,35.43 51.5,35.43 51.92,35.85 51.92,46.62 52.46,47.15 59.21,47.15 60.07,48.01 v60.07,54.57
MEM_MISO  (via drill 0.35)
  Top 0.254: U1.63 32.54,39.89 31.75,40.69 v31.75,51.72 | v60.06,70 SPI_MEMORY.2
  Bottom 0.254: v31.75,51.72 32.47,52.45 56.19,52.45 56.88,53.14 56.88,65.49 57.51,66.12 59.62,66.12 60.07,66.56 v60.07,70 | v60.07,70 | v60.07,70 v60.06,70
MEM_MOSI  (via drill 0.35)
  Top 0.254: U1.64 31.17,39.58 v31.17,52.33 | v55.92,60.98 v55.93,60.99 SPI_MEMORY.5
  Bottom 0.254: v31.17,52.33 31.85,53.01 55.33,53.01 55.92,53.61 v55.92,60.98
MEM_WP  (via drill 0.35)
  Top 0.254: U1.5 28.75,34.76 27.06,34.76 v27.05,34.74 | v58.79,70.59 SPI_MEMORY.3
  Bottom 0.254: v27.05,34.74 30.14,34.74 30.55,35.16 30.55,52.95 31.19,53.6 54.36,53.6 55.23,54.47 55.23,70.05 55.77,70.59 v58.79,70.59
N$1
  Top 0.254: R8.1 PF1.A
N$3
  Top 0.254: R5.2 47.09,33.53 47.79,34.22 47.79,36.07 48.52,36.8 Y2.1 52.39,36.8 C16.1
N$4
  Top 1.016: R14.2 R15.2 37.25,1.9 38.8,1.9 40,3.11 40,4.88 41.2,6.09 45.52,6.09 46.28,5.33 S1.2
N$5
  Top 0.203: U3.10 47.98,44.72 48.23,44.46 50.12,44.46 50.25,44.32 50.25,43.71 C5.1
N$7
  Top 0.381: MEM_PWR.1 61.35,51.75 61.35,60.98 SPI_MEMORY.8 62.77,60.99 63.06,61.27 63.06,72.29 R25.2
N$8  (via drill 0.35)
  Top 0.254: IC1.9 13.26,20.86 C20.1
  other vias: 21.79,21.6 28.82,21.61 39.37,10.16 40.38,10.11 40.41,9.14 39.35,9.1 39.37,11.11 39.37,12.17 39.38,13.12 39.92,13.67 38.8,13.7 36.13,14.25 36.13,15.21 36.14,16.18 36.13,17.16 30.55,8.91 31.59,8.91 31.57,9.96 30.57,9.94 31.07,9.47 31.09,10.45 31.61,10.96 30.56,10.98 31.08,11.49 31.57,11.99 30.59,11.97 31.09,12.44 31.61,12.98 30.54,13 31.05,13.55 32.16,13.5 33.07,13.56 34.13,13.58 35.19,13.58 36.21,13.58 37.25,13.56 32.16,12.48 32.11,11.53 32.14,10.46 32.09,9.47 40.87,13.67 20.76,21.6 19.75,21.61 18.75,21.61 17.73,21.61 28.83,20.6 27.82,20.59 26.83,20.57 25.82,20.6 24.8,20.61 23.8,20.61 22.81,20.59 21.78,20.59 22.76,21.64
  pour Top (isolate 0.254): 13.18,22.61 29.34,22.61 30.73,21.21 30.73,18.03 41.53,18.03 41.53,8.18 29.9,8.18 29.9,16.26 21.59,16.26 20.57,17.27 20.57,20.07 19.81,20.83 13.18,20.83
  pour Bottom (isolate 0.254): 13.18,22.61 29.34,22.61 30.73,21.21 30.73,18.03 41.53,18.03 41.53,8.18 29.88,8.18 29.88,16.26 21.59,16.26 20.57,17.27 20.57,20.07 19.81,20.83 13.18,20.83
N$9
  Top 0.254: R9.1 PF2.A
N$10
  Top 0.254: R10.1 PF3.A
N$12
  Top 0.813: Q1.4 37.8,6.65 38.1,6.35 38.1,4.53 R15.1
N$14  (via drill 0.35 pad 0)
  other vias: 24.62,4.39 24.62,3.4 24.63,2.37 25.65,4.39 25.65,3.4 25.66,2.37 26.69,4.43 26.69,3.44 26.7,2.41 27.72,4.43 27.72,3.44 27.73,2.41 28.75,4.43 28.75,3.44 28.76,2.41 29.78,4.43 29.78,3.44 29.79,2.41 30.82,4.46 30.82,3.48 30.83,2.44 31.85,4.46 31.85,3.48 31.86,2.44 26.69,5.41 27.72,5.41 28.75,5.41 29.78,5.41 30.82,5.44 31.85,5.44 26.7,6.4 27.75,6.39 28.79,6.4 29.75,6.43 30.78,6.45 31.79,6.53 32.93,4.59 33.98,4.59 35.39,5.09 34.01,5.3 32.91,5.38
  pour Bottom (isolate 0.254): 22.31,4.51 25.68,4.51 25.68,7.12 36.3,7.12 36.3,4.4 34.61,4.4 34.61,2.77 32.28,2.77 32.28,1.87 22.31,1.87
  pour Top (isolate 0.254): 22.3,4.6 25.68,4.6 25.68,7.13 36.3,7.13 36.3,4.4 34.61,4.4 34.61,2.77 32.28,2.77 32.28,1.86 22.3,1.86
N$16
  Top 1.016: R16.1 43.66,12.32 VIN.A
N$17  (via drill 0.35)
  Top 0.254: IC1.6 IC1.5 | IC1.5 IC1.4 14.64,16.65 v15.02,17.02 14.89,17.15 IC1.5 | IC1.6 15,17.65 v15,17.83 | v15,17.83 17.14,17.83 C27.2 | IC1.6 IC1.7 14.68,18.15 v15,17.83
  other vias: 19.05,15.24 21.72,10.92 22.73,10.92 23.75,10.92 24.77,10.92 25.78,10.92 26.8,10.92 19.3,14.35 19.3,13.59 19.3,12.95 19.3,12.19 20.83,10.92 20.07,10.92 19.43,11.3 18.41,16.89 17.27,16.89 18.56,15.94 16.11,16.95 27.74,10.93
  pour Top (isolate 0.254): 28.23,10.16 28.23,14.67 20.89,14.67 19.05,16.51 19.05,18.8 16,18.8 15.24,18.03 13.08,18.03 13.08,16.73 14.52,16.73 16.51,14.73 18.8,14.73 18.8,10.16
  pour Bottom (isolate 0.254): 13.08,18.02 15.23,18.02 16,18.8 19.05,18.8 19.05,16.51 20.87,14.69 28.2,14.69 28.2,10.16 18.8,10.16 18.8,14.73 16.51,14.73 14.49,16.75 13.08,16.75
N$18
  Top 0.813: Q2.4 22.81,8.21 R17.1
N$19
  Top 0.254: IC1.18 8.28,16.15 8,15.88 C24.1 R18.2
N$20
  Top 0.254: IC1.2 12.81,15.2 IC1.1 12.31,14.36 12.83,13.84 14.22,13.84 14.86,13.21 C22.1 C23.1
N$22
  Top 0.254: C25.1 10.2,9.98 R18.1
N$23
  Top 0.254: IC1.3 14.08,16.15 14.35,15.88 14.35,14.86 15.24,13.97 17.06,13.97 R20.2
N$24
  Top 0.254: R19.2 12.57,12.41 12.2,12.79 10.29,12.79 9.84,13.24 9.84,15.63 IC1.19
N$25
  Top 0.254: IC1.10 12.31,21.07 C26.1
N$26
  Top 0.254: IC1.8 14.86,18.65 15.98,19.78 C27.1
N$28
  Top 0.203: IC1.17 7.72,16.65 7.33,16.26 6.28,16.26 R21.1 R22.2
NRF_CE  (via drill 0.35, 0.35 pad 0)
  Top 0.254: U1.23 35.04,25.72 34.26,24.93 31.7,24.93 30.86,24.09 v30.86,23.52 | v45.91,8.65 46.5,8.06 53.67,8.06 54.22,8.61 54.22,10.95 NRF.3
  Bottom 0.254: v30.86,23.52 30.86,22.86 31.98,21.73 31.98,19.91 32.55,19.34 45.34,19.34 45.91,18.77 v45.91,8.65
NRF_IRQ  (via drill 0.35 pad 0)
  Top 0.254: U1.24 35.54,25.45 34.54,24.45 32.09,24.45 31.68,24.04 v31.68,23.55
  Bottom 0.254: v31.68,23.55 31.68,22.9 32.49,22.09 32.49,20.28 32.93,19.85 46.04,19.85 46.67,19.22 46.67,10.27 47.24,9.7 NRF.8
OSC0
  Top 0.254: U1.40 43.26,32.76 43.65,32.37 49.2,32.37 Y2.2 52.53,32.7 C1.1 | U1.40
OSC1
  Top 0.254: U1.41 44.34,33.26 R5.1
PC0_TCK_SWCLK
  Top 0.254: U1.52 38.04,40.41 38.7,41.06 54.71,41.06 55.29,41.64 55.28,41.64 55.28,43.09 55.52,43.33 JTAG+UART0.12 57.04,43.48 R4.2
PC1_TMS_SWDIO  (via drill 0.35)
  Top 0.254: U1.51 38.54,40.09 38.95,40.5 56.6,40.5 JTAG+UART0.10 | v54.13,41.94 52.43,41.94 R1.1
  Bottom 0.254: JTAG+UART0.10 56.88,41.57 56.51,41.94 v54.13,41.94
PC2_TDI
  Top 0.254: U1.50 39.04,39.82 39.23,40.01 54.98,40.01 55.43,39.56 55.43,38.85 56.03,38.25 JTAG+UART0.8
PC3_TDO_DWO
  Top 0.254: U1.49 54.27,38.71 54.88,38.1 54.88,36.15 55.32,35.71 JTAG+UART0.6
PD4  (via drill 0.35, 0.35 pad 0)
  Top 0.254: v38.77,30.55 39.54,30.55 40.17,29.92 v40.17,27.41 | v55.97,23.27 56.29,22.96 PD4.2 53.66,21.39 R7.1 | U1.43 39.27,34.26 v38.76,34.76
  Bottom 0.254: v40.17,27.41 40.17,25.95 40.86,25.26 52.47,25.26 52.84,24.89 52.84,23.79 53.35,23.28 55.97,23.28 v55.97,23.27 | v38.76,34.76 v38.76,30.56 v38.77,30.55
PF0  (via drill 0.35)
  Top 0.254: U1.28 v37.54,28.79 | PF0.2 56.32,17.24 v54.42,17.24 53.36,17.24 53.05,17.55 53.05,18.55 R6.1
  Bottom 0.254: v37.54,28.79 37.54,25.54 38.69,24.39 51.7,24.39 52.2,23.89 52.2,17.69 52.65,17.24 v54.42,17.24
PF1
  Top 0.254: U1.29 38.04,24.99 38.65,24.39 40.28,24.39 40.9,23.76 40.9,23.02 41.42,22.51 44.03,22.51 R8.2
PF2
  Top 0.254: U1.30 38.54,25.33 38.95,24.92 40.65,24.92 41.98,23.59 46.11,23.59 46.28,23.42 R9.2
PF3
  Top 0.254: U1.31 39.04,25.7 39.3,25.44 40.91,25.44 42.26,24.09 48.06,24.09 48.52,23.62 48.52,22.52 R10.2
RMN  (via drill 1.02)
  other vias: 45.72,63.83
  pour Top (isolate 0.127, no thermals): 46.71,62.83 34.3,62.83 33.92,62.45 33.92,61.69 33.91,61.68 33.91,61.68 33.62,61.68 33.62,62.59 33.64,62.61 35.87,64.85 46.6,64.85 46.75,64.7 46.75,62.82 46.75,62.83 46.72,62.83 46.72,62.83 46.72,62.83 46.72,62.82 46.72,62.82
RMNI
  Top 0.254: IC3.9 32.77,55.58 33.47,54.88 34.4,54.88 35.04,54.23 U1.58
RMP  (via drill 1.02)
  other vias: 45.72,71.32
  pour Top (isolate 0.127, no thermals): 33.43,61.68 33.43,62.7 35.86,65.13 42.37,65.13 43.61,66.37 43.61,69.64 44.27,70.3 46.71,70.3 46.71,72.33 46.71,72.33 43.86,72.33 42.16,70.63 42.16,67.05 41.79,66.68 35.25,66.68 33.11,64.54 33.11,61.68 33.43,61.68
RMPI
  Top 0.254: IC3.10 33.27,56.02 33.76,55.53 34.9,55.53 35.54,54.88 U1.57
RST_UC  (via drill 0.35)
  Top 0.254: U1.38 40.09,31.76 v39.56,32.28 | JTAG+UART0.4 57.84,33.17 58.12,32.88 58.12,25.67 57.87,25.41 RESET.2 56.29,25.41 C13.1 53.08,25.4 R3.1
  Bottom 0.254: JTAG+UART0.11 58.41,43.33 58.13,43.05 58.13,34.41 JTAG+UART0.4 40.44,33.17 v39.56,32.28
SCL  (via drill 0.35, 0.35 pad 0)
  Top 0.203: U3.23 47.18,49.28
  Top 0.254: U1.47 43.03,36.26 43.42,36.65 v43.42,37.41 | R12.1 42.4,49.47 42.66,49.72 v43.42,49.72 | I2C.4 48.13,50.83 v47.49,50.19 47.18,49.88 47.18,49.28
  Bottom 0.254: v43.42,37.41 v43.42,49.72 43.89,50.19 v47.49,50.19
SDA  (via drill 0.35, 0.35 pad 0)
  Top 0.203: R11.2 45.01,48.53 U3.24 46.78,49.25
  Top 0.254: U1.48 v41.49,37.51 v41.5,37.51 | 46.78,49.25 46.78,49.26 v46.78,50.7 46.78,51.98 47.29,52.5 53.41,52.5 53.84,52.07 I2C.3
  Bottom 0.254: v41.5,37.51 41.5,50.25 41.95,50.71 v46.77,50.71 v46.78,50.7
SEN1  (via drill 0.35)
  Top 0.254: U1.44 39.7,34.76 39.56,34.89 v39.56,36.1 | v39.56,49.37 39.56,54.95 40.13,55.52 49.21,55.52 51.01,57.32 51.01,81.5 50.34,82.17 23.25,82.17 22.81,81.73 22.81,76.96 22.59,76.74 IR_ARRAY.4
  Bottom 0.254: v39.56,36.1 v39.56,49.37
SEN2  (via drill 0.35)
  Top 0.254: U1.53 37.54,37.55 37.76,37.34 v39.03,37.34 | v39.03,50.34 39.03,55.48 39.55,56 48.9,56 50.32,57.42 v50.32,78.07
  Bottom 0.254: IR_ARRAY.3 21.55,78.54 22.04,78.04 22.07,78.07 v50.32,78.07 | v39.03,50.34 v39.03,37.34
SEN3  (via drill 0.35)
  Top 0.254: U1.10 28.97,32.26 v28.55,31.84 | v38.46,49.49 38.46,55.88 38.98,56.4 48.52,56.4 49.43,57.31 49.43,80.92 48.77,81.57 31.1,81.57 30.4,80.87 30.4,77.53 30.41,77.52 29.63,76.74 IR_ARRAY.10
  Bottom 0.254: v28.55,31.84 32.95,31.84 33.13,32.02 33.13,39.84 33.59,40.3 38.14,40.3 38.46,40.62 v38.46,49.49
SEN4  (via drill 0.35)
  Top 0.254: U1.9 v28.56,32.76 v28.55,32.75 | v37.88,50.26 37.88,56.43 38.24,56.78 48.06,56.78 48.93,57.65 48.93,80.61 48.6,80.94 44.67,80.94 44.4,80.67 44.4,79.29 IR_ARRAY.21
  Bottom 0.254: v28.55,32.75 32.41,32.75 32.57,32.9 32.57,33.4 32.57,40.14 33.23,40.81 37.27,40.81 37.88,41.41 v37.88,50.26
SEN5  (via drill 0.35)
  Top 0.254: U1.8 28.86,33.26 v28.48,33.64 | v37.25,49.56 37.25,56.84 37.59,57.18 47.46,57.18 48.24,57.96 48.24,74.25 47.89,74.6 41.11,74.6 40.59,75.12 40.59,78.97 40.28,79.28 IR_ARRAY.17
  Bottom 0.254: v28.48,33.64 28.85,33.27 32.04,33.27 32.19,33.42 32.19,40.64 33.01,41.47 36.51,41.47 37.24,42.2 v37.24,49.56 v37.25,49.56
SEN6  (via drill 0.35)
  Top 0.254: U1.7 31.24,33.76 31.48,33.99 v31.48,34.31 | v36.69,50.36 36.69,57.22 37.2,57.73 47.07,57.73 47.59,58.26 47.59,72.82 46.86,73.56 v46.41,73.56
  Bottom 0.254: v31.48,34.31 31.48,40.92 32.56,42.01 36.52,42.01 36.69,42.18 v36.69,50.36 | v46.41,73.56 37.53,73.56 36.76,74.33 36.76,76.71 IR_ARRAY.16
SENLED  (via drill 0.35)
  Top 0.254: U1.45 40.21,35.26 v40.11,35.36 | v40.1,50.44 40.1,54.62 40.39,54.91 49.5,54.91 51.62,57.02 v51.62,72.4 | IR_ARRAY.18 39.33,73.26 v39.73,72.87
  Bottom 0.254: v40.11,35.36 40.11,50.43 v40.1,50.44 | v39.73,72.87 51.15,72.87 v51.62,72.4
SERVO1
  Top 0.254: U1.1 30.09,57.69 29.38,58.4 18.49,58.4 17.8,59.09 17.8,69.64 17.1,70.34 SERVOS.6
SERVO2  (via drill 0.35)
  Top 0.254: U1.4 27.89,35.26 v27.86,35.29 | v27.8,57.56 17.22,57.56 16.51,58.27 16.51,58.28 16.51,67.13 15.84,67.8 SERVOS.5
  Bottom 0.254: v27.8,57.56 27.86,57.5 v27.86,35.29
SSI0_CLK  (via drill 0.35 pad 0)
  Top 0.254: U1.19 33.04,28.47 v33.34,28.76
  Bottom 0.254: v33.34,28.76 34.3,27.8 34.3,22.07 34.9,21.47 49.92,21.47 50.38,21.02 NRF.5
SSI0_FSS  (via drill 0.35 pad 0)
  Top 0.254: U1.20 33.54,26.34 33.39,26.19 29.69,26.19 v28.89,25.4
  Bottom 0.254: v28.89,25.4 32.44,25.4 33.68,24.15 33.68,21.67 34.36,20.99 48.49,20.99 49.1,20.38 49.1,11.62 49.71,11.01 52.31,11.01 52.92,10.4 NRF.4
SSI0_MISO  (via drill 0.35 pad 0)
  Top 0.254: U1.21 34.04,26.12 33.72,25.8 30.52,25.8 29.26,24.54 v29.24,24.56
  Bottom 0.254: v29.24,24.56 32.13,24.56 32.97,23.71 32.97,20.98 33.51,20.44 47.27,20.44 47.84,19.88 NRF.7
SSI0_MOSI  (via drill 0.35 pad 0)
  Top 0.254: U1.22 34.54,25.9 33.99,25.34 31.04,25.34 30.14,24.45 v30.14,23.5
  Bottom 0.254: v30.14,23.5 30.14,22.82 31.4,21.56 31.4,19.45 32.06,18.79 41.75,18.79 42.23,18.31 42.23,7.71 42.79,7.15 49.75,7.15 50.38,7.78 NRF.6
U0_RX  (via drill 0.35)
  Top 0.254: U1.17 32.04,29.96 v32.05,29.97
  Bottom 0.254: v32.05,29.97 32.67,29.97 32.68,29.97 54.39,29.97 55.96,28.4 60.6,28.4 61.3,29.1 61.3,37.56 60.61,38.25 JTAG+UART0.7
U0_TX  (via drill 0.35)
  Top 0.254: U1.18 32.54,29.09 v32.9,29.44 v32.9,29.45 v32.89,29.45
  Bottom 0.254: v32.89,29.45 53.95,29.45 55.54,27.86 60.94,27.86 61.71,28.63 61.71,39.69 60.61,40.79 JTAG+UART0.9
VCC
  Top 0.203: U3.13 48.96,46.03 48.93,46.05 48.23,46.05 | 48.23,46.05 | 48.23,46.05 48.13,46.05 | U3.9 U3.8 47.18,44.78 46.87,44.47 IMU_PWR.2 | U3.9 47.58,44.13 C12.1 | U3.9 47.58,46.06 | 47.58,46.06 U3.22 | 48.13,46.05 | 48.13,46.05 47.83,46.05 | 47.83,46.05 | 47.83,46.05 47.58,46.05 47.58,46.06
  Top 0.254: IMU_PWR.2 44.6,44.49 R11.1 R12.2
VDD  (via drill 0.35)
  Top 0.381: 38.1,33.76 37.36,33.76 37.04,34.08 v37.04,35.56 U1.54 37.04,40.85 37.85,41.66 40.13,41.66 40.68,42.2 C14.1 40.68,48.86 42.77,50.96 v42.77,54.27 | 38.1,33.76 U1.42 42.82,33.76 43.63,34.57 44.31,34.57 44.62,34.88 C8.1 v44.62,36.98 | 38.1,31.26 36.84,31.26 36.54,30.96 U1.26 36.54,24.88 36.81,24.61 37.51,24.61 38.16,23.96 C2.1 38.17,23.5 v40.05,23.5 | 38.1,31.26 U1.37 | 38.1,31.26 38.1,33.76 | IC3.11 IC3.12 34.27,59 C33.1 37.03,58.34 v37.05,58.36 | IMU_PWR.1 v44.62,41.64 | R1.2 52.41,47.42 52.97,47.98 54.85,47.98 | 54.85,47.98 v56.82,47.98 58.43,47.98 58.74,47.67 58.74,45.98 58.71,45.95 R4.1 61.46,45.93 61.5,45.88 | U1.11 34.19,31.76 34.93,32.51 v34.93,35.59 34.26,36.26 U1.2 C4.1 C9.1 | C9.1 | C9.1 23.24,36.26 | 23.24,36.26 C18.1 21.27,36.26 19.52,38.01 8.9,38.01 8.9,38 8.42,38.48 8.42,42.2 | v23.24,26.04 23.24,36.25 23.24,36.26 | IR_ARRAY.13 33.01,78.04 33.01,70.12 33.67,69.47 v40.67,69.47 | R3.2 R7.2 51.37,20.79 R6.2 51.39,18.58 v51.39,17.03 51.39,15.54 52.07,14.85 52.08,14.85 56.27,14.85 57.11,14.01 57.11,10.26 56.55,9.7 NRF.2 | MEM_PWR.2 61.5,45.88 | 61.5,45.88 61.5,36.14 61.07,35.71 JTAG+UART0.5 | GPS.2 8.42,42.2 | 8.42,42.2 4.98,42.2 4.44,42.74 4.44,48.74 5.14,49.44 JEVOIS.2 | I2C.2 54.84,47.99 54.85,47.98
  Bottom 0.381: v34.93,35.59 37.02,35.59 v37.04,35.56 | v44.62,36.98 v44.62,41.64 44.62,46.67 45.92,47.98 v56.82,47.98 | v40.67,69.47 42.19,69.47 42.77,68.88 42.77,58.32 | 42.77,58.32 v42.77,54.27 | v37.05,58.36 42.73,58.36 42.77,58.32 | v51.39,17.03 51.39,23.02 50.91,23.5 v40.05,23.5
  other vias: 13.34,29.59 13.34,28.7 13.34,27.56 13.34,26.29 14.61,26.29 14.61,27.56 15.88,27.56 15.88,26.29 17.14,26.29 17.14,27.56 20.7,27.05 20.7,26.04 21.97,26.04
  pour Top (isolate 0.254): 18.29,30.23 12.7,30.23 12.7,25.4 24.13,25.4 24.13,26.67 21.84,26.67
  pour Bottom (isolate 0.254): 12.7,30.23 12.7,25.4 24.13,25.4 24.13,26.67 21.85,26.67 18.29,30.23
VDDC
  Top 0.254: C7.1 C17.1 C11.1 37.5,42.58 36.04,41.12 U1.56 U1.25 36.04,25.27 34.96,24.18 C6.1
VIN  (via drill 0.35 pad 0)
  other vias: 5.35,1.74 3.83,1.17 2.8,1.16 1.77,1.19 1.78,2.21 1.78,3.21 2.31,3.74 4.85,1.2 5.89,1.19 15.52,4.42 15.56,3.38 15.59,2.36 14.54,1.32 15.59,1.32 15.57,5.48 14.54,5.47 6.88,1.19 7.92,1.2 5.88,2.26 6.89,2.25 6.34,2.78 7.39,2.77 6.89,3.47 6.35,3.98 6.92,4.51 7.41,5.02 7.97,5.56 8.45,6.07 13.58,5.49 13.54,2.34 13.51,1.36 14.58,2.36 14.53,3.36 14.53,4.42 13.58,4.37 13.57,3.33 13.08,5.98 7.64,1.96
  pour Top (isolate 0.254): 1.88,4.4 5.64,4.4 7.86,6.62 21.24,6.62 21.24,0.5 1.02,0.5 1.02,4.4 1.87,4.4 1.87,4.4
  pour Bottom (isolate 0.254): 1.07,4.41 5.66,4.41 7.88,6.62 21.22,6.62 21.22,0.56 1.02,0.56 1.02,4.4 1.06,4.4
VM  (via drill 0.35)
  Top 0.254: IC1.14 8.55,18.15 v8.55,18.99 | IC1.15 8.56,17.65 v8.56,17.99 | IC1.16 8.06,17.15 v8.06,17.44
  other vias: 8.07,20.14 8.19,25.35 8.32,31.32 10.16,35.56 10.19,34.53 10.17,33.51 11.2,33.52 11.19,34.53 11.21,35.53 12.24,35.54 12.25,34.53 12.26,33.53 7.56,19 13.26,35.54 13.26,34.53 13.28,33.52 35.64,60.98 36.63,60.99 37.67,60.97 38.7,60.95 39.22,60.44 39.73,60.96 38.2,60.47 37.17,60.48 36.14,60.5 35.58,59.96 36.63,59.95 37.66,59.97 38.71,59.95 39.73,59.95 7.53,18.01 9.14,35.54 9.13,34.53 9.13,33.52 9.67,33.01 10.7,33.02 11.72,33 12.77,33.01 13.81,33.03 13.81,34.05 13.78,35.04 14.32,35.55 15.32,35.57 14.78,35.04 15.86,35.04 16.35,35.53 16.84,35 17.38,35.56 9.65,34.04 10.69,34.04 11.72,34.04 12.76,34.06 12.73,35.07 11.7,35.06 10.69,35.04 9.64,35.04 8.14,35.6 8.13,34.53 8.65,35.07 8.63,34.03 8.63,33.04 9.16,32.55 10.17,32.51 11.23,32.5 12.26,32.54 13.28,32.47 8.1,32.51 8.14,33.55 7.62,35.07 7.65,34.03 7.62,33 7.14,32.52 7.15,33.51 7.12,34.57 7.11,35.56 7.61,36.09 8.65,36.09 9.67,36.07 10.69,36.09 11.74,36.03 12.72,36.06 13.78,36.07 14.81,36.05 15.82,36.06 16.83,36.09 12.14,72.93 12.15,73.95 12.14,74.91 12.16,75.93 12.14,76.91 40.21,60.45 40.24,61.45 39.22,61.49 38.19,61.45 37.17,61.45 36.15,61.49 35.6,62.03 36.66,62 37.7,61.95 38.69,61.93 39.73,62 12.22,65.26 12.24,64.25 12.27,63.19
  pour Top (isolate 0.254, no thermals): 34.21,62.37 40.89,62.37 40.89,59.26 35.09,59.26 35.09,61.77 34.19,61.77
  pour Top (isolate 0.254, rank 2): 10.32,18.21 9.09,18.21 9.09,26.35 9.09,32.1 16.48,32.1 18.34,32.1 18.34,36.86 5.09,36.86 5.09,32.48 5.09,17.11 10.29,17.11 10.33,17.11 10.33,18.21
  pour Bottom (isolate 0.254, rank 2): 11.14,77.94 11.14,36.86 5.1,36.86 5.1,17.15 10.22,17.15 10.22,18.2 9.12,18.2 9.12,32.13 18.33,32.13 18.33,59.42 40.87,59.42 40.87,62.52 13.28,62.52 13.28,77.94
  pour Top (isolate 0.254): 13.25,62.54 13.25,75.48 20.32,75.48 20.32,77.94 11.13,77.94 11.13,62.54
XOSC0
  Top 0.254: U1.34 42.62,29.76 43.12,29.26 43.12,25.69 43.51,25.3 C15.1 46.46,25.3 46.83,25.67 Y3.2
XOSC1
  Top 0.254: U1.36 C3.1 46.52,30.75 46.83,30.44 Y3.3

### Text on the board
tNames: SERVO1 | SERVO2 | GND | VM | SIG | ZUMO:TM4C123 | Y | Z | X | Tx | SCL | SDA | Rx | TCK | RESET | Tx | TMS | TX | Rx | TDI | RX | TDO | VDD | RESET | NC | GND | GND | S | S | - | OFF | ON | + | + | -